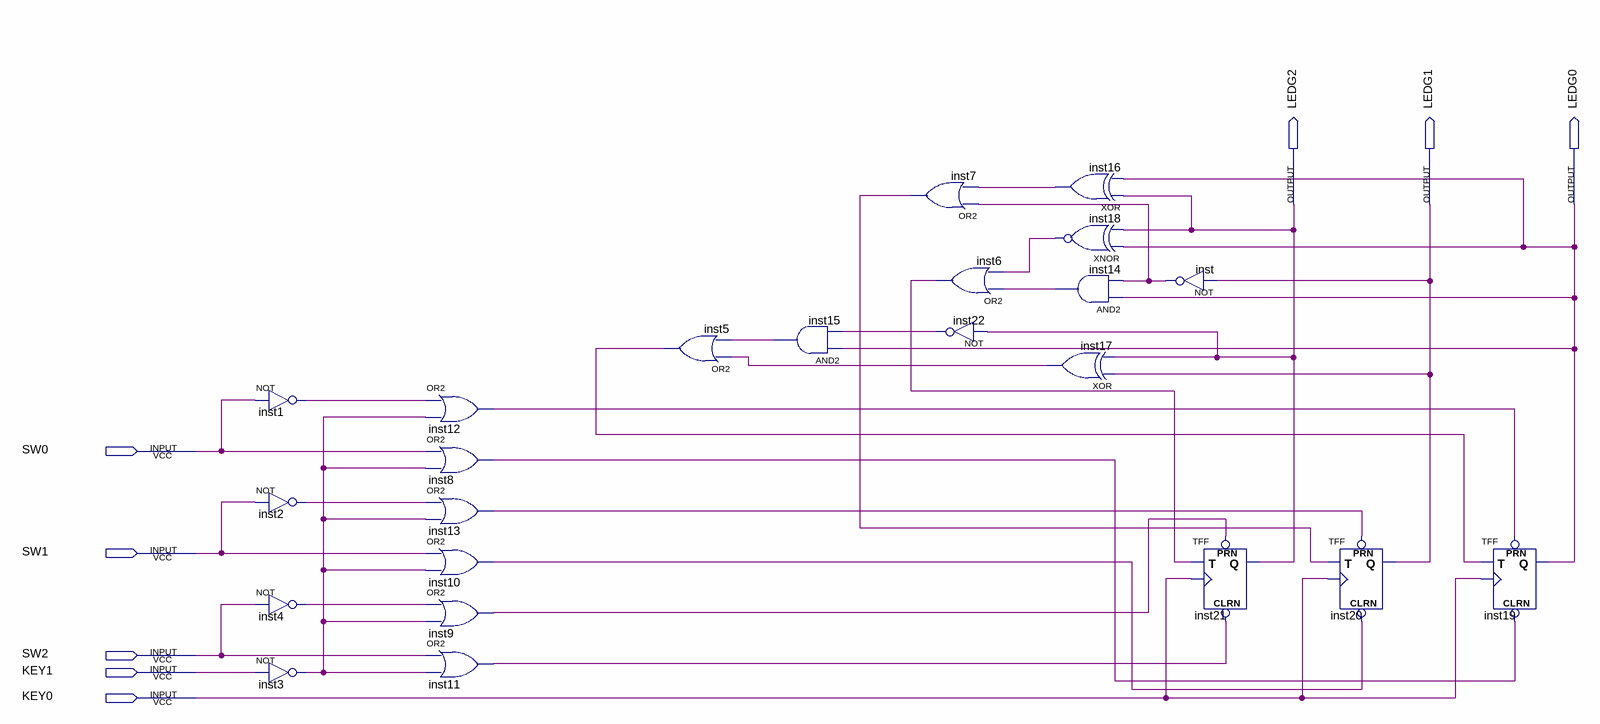
[diagram p0: schematic sheet]
// Quartus schematic BODEMDINHGIATRIBANDAU.bdf as structural Verilog: 23 symbols, 8 pins
module BODEMDINHGIATRIBANDAU (
  input  SW0,
  input  SW1,
  input  SW2,
  input  KEY1,
  input  KEY0,
  output LEDG2,
  output LEDG1,
  output LEDG0
);

  wire inst1_out, inst2_out, inst3_out, inst4_out, inst5_out, inst6_out, inst7_out, inst8_out, inst9_out,
       inst10_out, inst11_out, inst12_out, inst13_out, inst14_out, inst15_out, inst16_out, inst17_out,
       inst18_out, inst22_out, inst_out;

  not inst1 (inst1_out, SW0);
  not inst2 (inst2_out, SW1);
  not inst4 (inst4_out, SW2);
  not inst3 (inst3_out, KEY1);
  or inst12 (inst12_out, inst1_out, inst3_out);
  or inst8 (inst8_out, SW0, inst3_out);
  or inst13 (inst13_out, inst2_out, inst3_out);
  or inst10 (inst10_out, SW1, inst3_out);
  or inst9 (inst9_out, inst4_out, inst3_out);
  or inst11 (inst11_out, SW2, inst3_out);
  or inst5 (inst5_out, inst17_out, inst15_out);
  and inst15 (inst15_out, LEDG0, inst22_out);
  or inst7 (inst7_out, inst_out, inst16_out);
  or inst6 (inst6_out, inst14_out, inst18_out);
  not inst22 (inst22_out, LEDG2);
  xor inst16 (inst16_out, LEDG2, LEDG0);
  xnor inst18 (inst18_out, LEDG0, LEDG2);
  and inst14 (inst14_out, LEDG0, inst_out);
  xor inst17 (inst17_out, LEDG1, LEDG2);
  not inst (inst_out, LEDG1);
  TFF inst21 (.PRN(inst9_out), .CLRN(inst11_out), .T(inst6_out), .CLK(KEY0), .Q(LEDG2));
  TFF inst20 (.PRN(inst13_out), .CLRN(inst10_out), .T(inst7_out), .CLK(KEY0), .Q(LEDG1));
  TFF inst19 (.PRN(inst12_out), .CLRN(inst8_out), .T(inst5_out), .CLK(KEY0), .Q(LEDG0));
endmodule
